# EAGLE design GSM_GPS (EAGLE 9.6.2)
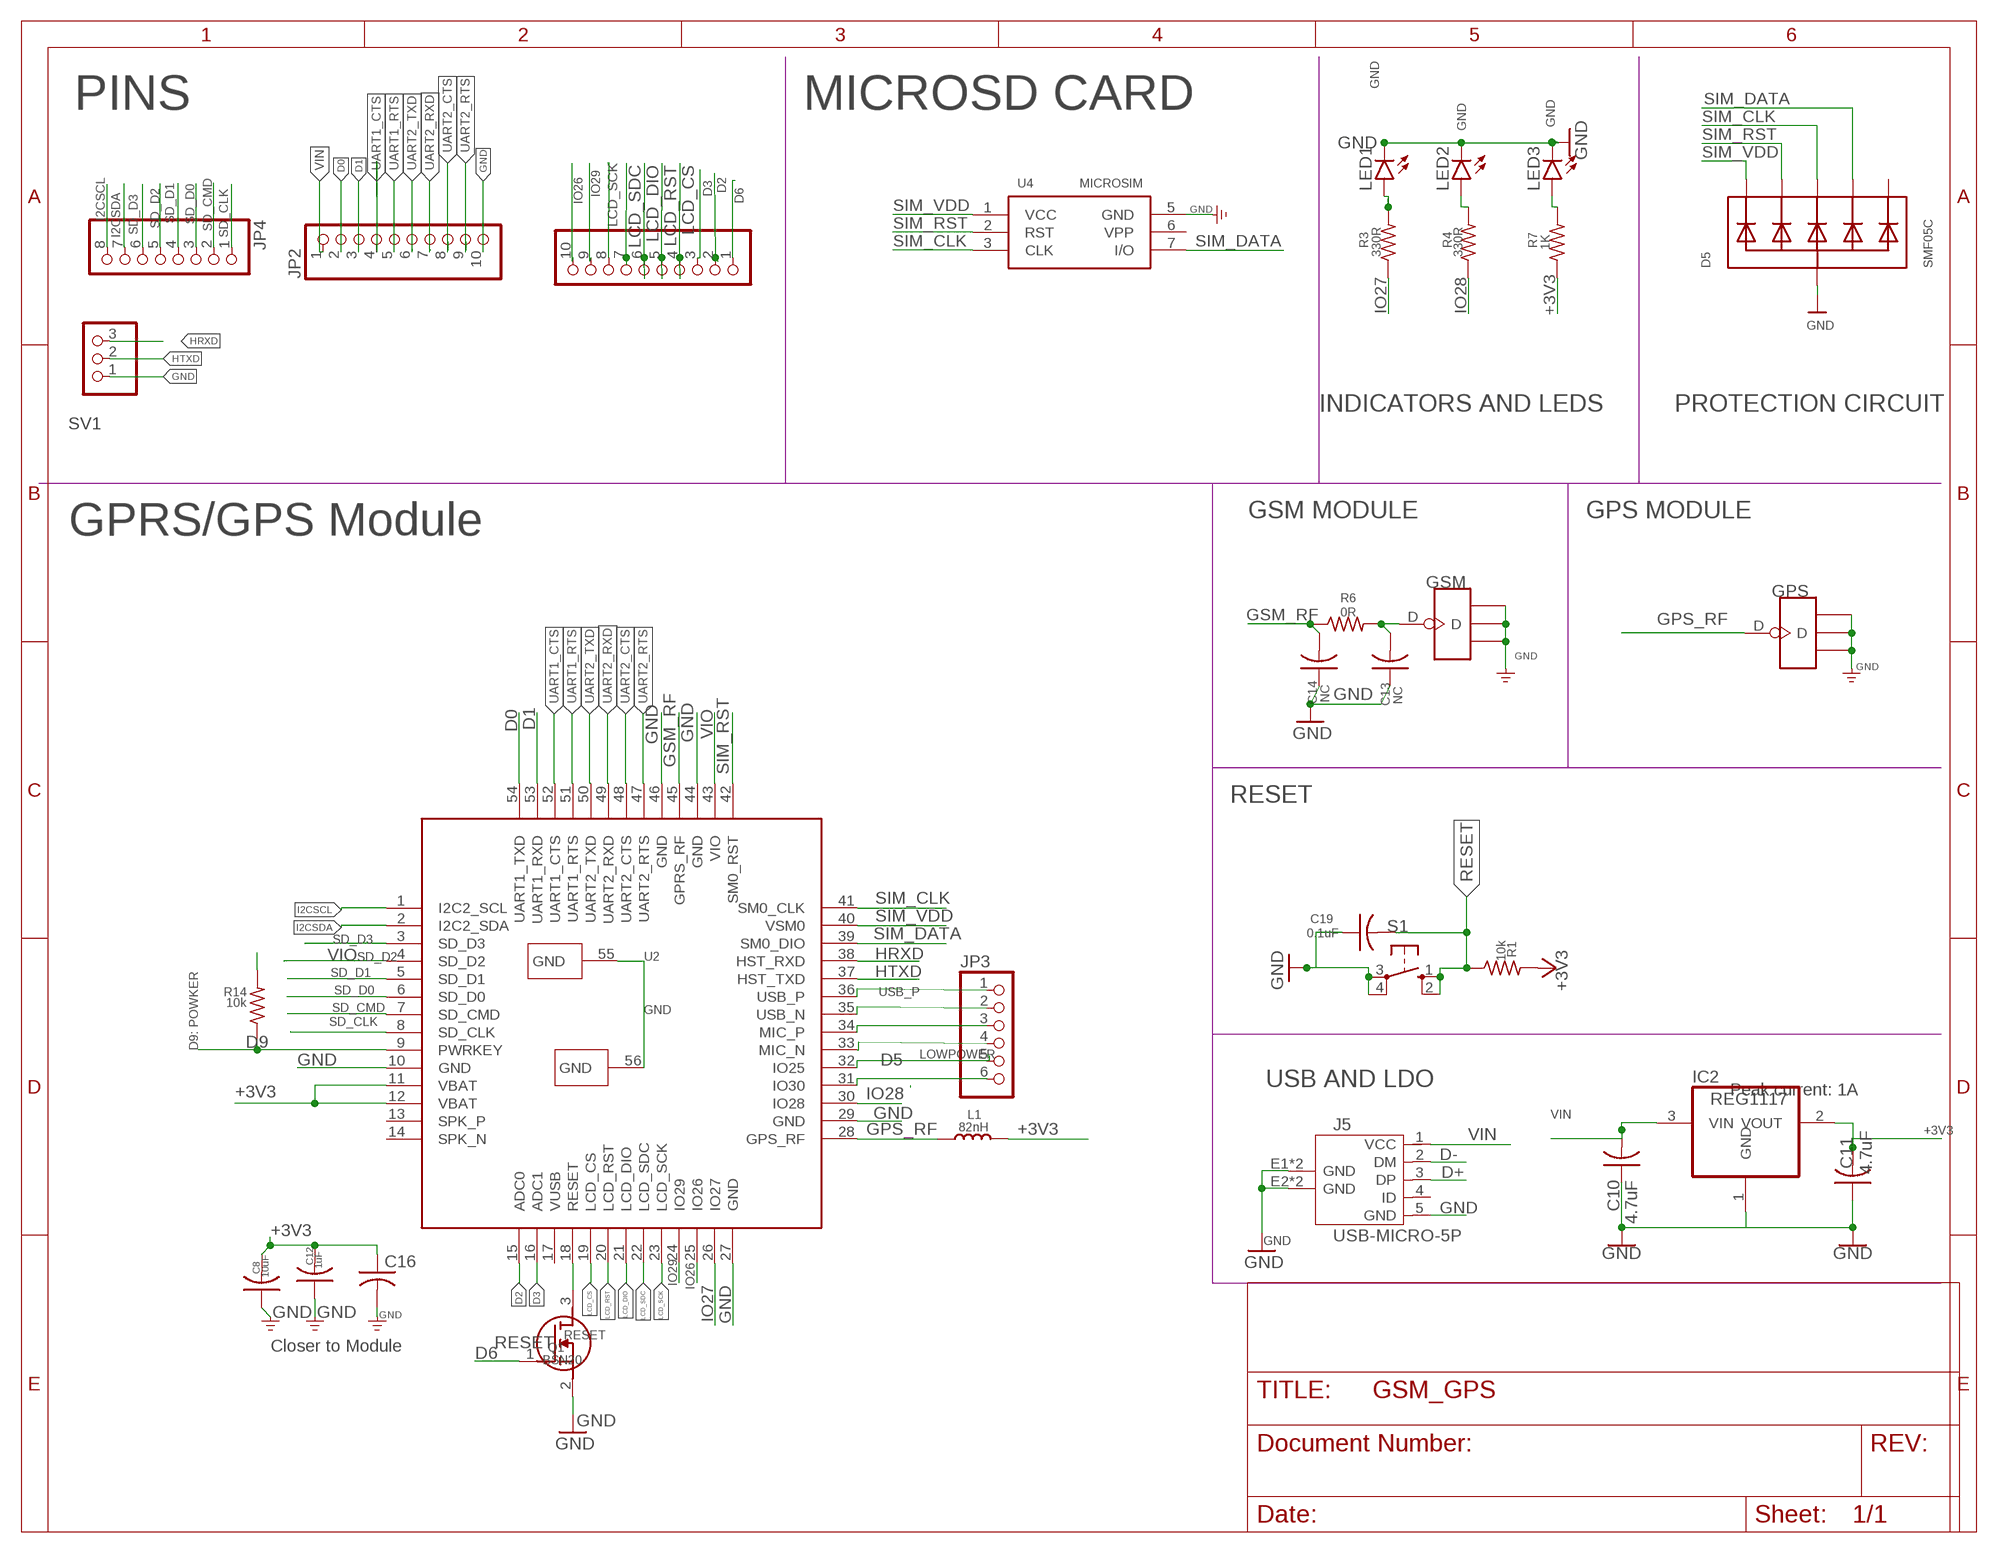
[diagram p0: schematic, sheet 1]

## Parts
C8  10uF  C-USC0805  [C0805]
C10  4.7uF  C-USC0805  [C0805]
C11  4.7uF  C-USC0805  [C0805]
C12  1uF  C-USC0805  [C0805]
C13  NC  C-USC0805  [C0805]
C14  NC  C-USC0805  [C0805]
C16  100uF  C-USC0805  [C0805]
C19  0.1uF  C-USC0805  [C0805]
D5  SMF05C  TVSARRAY_5LANE  [SOT363]
GPS  ANTENNA-U-FL  [4P-U-FL]
GSM  ANTENNA-U-FL  [4P-U-FL]
IC2  REG1117  [SOT223]
J2  PINHD-1X10  [1X10]
J5  USB-MICRO-5P  [MICRO-USB-5P]
JP2  PINHD-1X10  [1X10]
JP3  PINHD-1X6  [1X06]
JP4  PINHD-1X8  [1X08]
L1  82nH  L'0603'  [L0603]
LED1  LEDCHIPLED_0805  [CHIPLED_0805]
LED2  LEDCHIPLED_0805  [CHIPLED_0805]
LED3  LEDCHIPLED_0805  [CHIPLED_0805]
Q1  BSN20  SI2302CDS-T1-E3  [SOT95P237X112-3N]
R1  10k  R-US_R0805  [R0805]
R3  330R  R-US_R0805  [R0805]
R4  330R  R-US_R0805  [R0805]
R6  0R  R-US_R0805  [R0805]
R7  1K  R-US_R0805  [R0805]
R14  10k  R-US_R0805  [R0805]
S1  10-XX  [B3F-10XX]
SV1  PINHD-1X3  [1X03]
U2  A9G  [A9G]
U4  MICROSIM  [MICROSIM]

## Nets
+3V3: C8.2 C11.2 C12.2 C16.1 IC2.2(VOUT) L1.2 R1.2 R7.1 U2.11(VBAT) U2.12(VBAT)
D0: JP2.2 U2.54(UART1_TXD)
D1: JP2.3 U2.53(UART1_RXD)
D2: J2.2 U2.15(ADC0)
D3: J2.3 U2.16(ADC1)
D5: JP3.5 U2.32(IO25)
D6: J2.1 Q1.1(G)
D9: R14.1 U2.9(PWRKEY)
D+: J5.3(DP)
D-: J5.2(DM)
GND: C8.1 C10.1 C11.1 C12.1 C13.1 C14.1 C16.2 C19.1 D5.2(A) GPS.GND1 GPS.GND2 GPS.GND3 GSM.GND1 GSM.GND2 GSM.GND3 IC2.1(GND) J5.5(GND) J5.E1(GND) J5.E2(GND) J5.P1(GND) J5.P2(GND) JP2.10 LED1.C LED2.C LED3.C Q1.2(S) S1.3(P) S1.4(P1) SV1.1 U2.10(GND) U2.27(GND) U2.29(GND) U2.44(GND) U2.46(GND) U2.55(GND) U2.56(GND) U4.5(GND)
GPS_RF: GPS.D L1.1 U2.28(GPS_RF)
GSM_RF: C14.2 R6.1 U2.45(GPRS_RF)
HRXD: SV1.3 U2.38(HST_RXD)
HTXD: SV1.2 U2.37(HST_TXD)
I2CSCL: JP4.8 U2.1(I2C2_SCL)
I2CSDA: JP4.7 U2.2(I2C2_SDA)
IO26: J2.10 U2.25(IO26)
IO27: R3.1 U2.26(IO27)
IO28: R4.1 U2.30(IO28)
IO29: J2.9 U2.24(IO29)
LCD_CS: J2.4 U2.19(LCD_CS)
LCD_DIO: J2.6 U2.21(LCD_DIO)
LCD_RST: J2.5 U2.20(LCD_RST)
LCD_SCK: J2.8 U2.23(LCD_SCK)
LCD_SDC: J2.7 U2.22(LCD_SDC)
N$1: LED2.A R4.2
N$2: JP3.6 U2.31(IO30)
N$3: LED3.A R7.2
N$4: JP3.3 U2.34(MIC_P)
N$5: JP3.4 U2.33(MIC_N)
N$7: LED1.A R3.2
N$8: JP3.2 U2.35(USB_N)
N$94: C13.2 GSM.D R6.2
RESET: C19.2 Q1.3(D) R1.1 S1.1(S) S1.2(S1) U2.18(RESET)
SD_CLK: JP4.1 U2.8(SD_CLK)
SD_CMD: JP4.2 U2.7(SD_CMD)
SD_D0: JP4.3 U2.6(SD_D0)
SD_D1: JP4.4 U2.5(SD_D1)
SD_D2: JP4.5 U2.4(SD_D2)
SD_D3: JP4.6 U2.3(SD_D3)
SIM_CLK: D5.4(C3) U2.41(SM0_CLK) U4.3(CLK)
SIM_DATA: D5.5(C4) U2.39(SM0_DIO) U4.7(I/O)
SIM_RST: D5.3(C2) U2.42(SM0_RST) U4.2(RST)
SIM_VDD: D5.1(C1) U2.40(VSM0) U4.1(VCC)
UART1_CTS: JP2.4 U2.52(UART1_CTS)
UART1_RTS: JP2.5 U2.51(UART1_RTS)
UART2_CTS: JP2.8 U2.48(UART2_CTS)
UART2_RTS: JP2.9 U2.47(UART2_RTS)
UART2_RXD: JP2.7 U2.49(UART2_RXD)
UART2_TXD: JP2.6 U2.50(UART2_TXD)
USB_P: JP3.1 U2.36(USB_P)
VIN: C10.2 IC2.3(VIN) J5.1(VCC) JP2.1
VIO: R14.2 U2.43(VIO)
Unconnected: D5.6(C5) J5.4(ID) U2.13(SPK_P) U2.14(SPK_N) U2.17(VUSB) U4.6(VPP)

## Notes on the sheet
- PINS | MICROSD CARD
- INDICATORS AND LEDS
- PROTECTION CIRCUIT
- GSM MODULE | GPS MODULE
- GPRS/GPS Module
- RESET
- D9: POWKER
- LOWPOWER
- USB AND LDO
- Peak current: 1A
- RESET
- Closer to Module

## Library data of the parts
C8 C10-C14 C16 C19 = rcl:C-US: CAPACITOR, American symbol; SPICEPREFIX: C
D5 = microbuilder:TVSARRAY_5LANE: Voltage Transient Suppressor Array SOT363 SMF05C - 100W 5V: Digikey - SMF05CT1GOSCT-ND
GPS GSM = Connector:ANTENNA-U-FL
IC2 = burr-brown:REG1117: 800mA and 1A Low Dropout (LDO) Positive Regulator 1.8V, 2.5V, 2.85V, 3.3V, 5V, and Adj; MPN: REG1117; OC_FARNELL: 1097566; OC_NEWARK: 14P6981
J2 JP2 = pinhead:PINHD-1X10: PIN HEADER
J5 = Connector:USB-MICRO-5P
JP3 = pinhead:PINHD-1X6: PIN HEADER
JP4 = pinhead:PINHD-1X8: PIN HEADER
L1 = Discrete:L*
LED1-LED3 = led:LED: LED OSRAM: - CHIPLED LG R971, LG N971, LY N971, LG Q971, LY Q971, LO R971, LY R971 LH N974, LH R974 LS Q976, LO Q976, LY Q976 LO Q996 - Hyper CHIPLED LW Q18S LB Q993, LB Q99A, LB R99A - SideLED LS A670, LO A670, LY A670, LG A670, LP A670 LB A673, LV A673, LT A673, LW A673 LH A674 LY A675 LS A676, LA A676, LO A676, LY A676, LW A676 LS A679, LY A679, LG A679 - Hyper Micro SIDELED® LS Y876, LA Y876, LO Y876, LY Y876 LT Y87S - SmartLED LW L88C, LW L88S LB L89C, LB L89S, LG L890 LS L89K, LO L89K, LY L89K LS L896, LA L896, LO L896, LY L896 - TOPLED LS T670, LO T670, LY T670, LG T670, LP T670 LSG T670, LSP T670, LSY T670, LOP T670, LYG T670 LG T671, LOG T671, LSG T671 LB T673, LV T673, LT T673, LW T673 LH T674 LS T676, LA T676, LO T676, LY T676, LB T676, LH T676, LSB T676, LW T676 LB T67C, LV T67C, LT T67C, LS T67K, LO T67K, LY T67K, LW E67C LS E67B, LA E67B, LO E67B, LY E67B, LB E67C, LV E67C, LT E67C LW T67C LS T679, LY T679, LG T679 LS T770, LO T770, LY T770, LG T770, LP T770 LB T773, LV T773, LT T773, LW T773 LH T774 LS E675, LA E675, LY E675, LS T675 LS T776, LA T776, LO T776, LY T776, LB T776 LHGB T686 LT T68C, LB T68C - Hyper Mini TOPLED® LB M676 - Mini TOPLED Santana® LG M470 LS M47K, LO M47K, LY M47K Source: http://www.osram.convergy.de LUXEON: - LUMILED® LXK2-PW12-R00, LXK2-PW12-S00, LXK2-PW14-U00, LXK2-PW14-V00 LXK2-PM12-R00, LXK2-PM12-S00, LXK2-PM14-U00 LXK2-PE12-Q00, LXK2-PE12-R00, LXK2-PE12-S00, LXK2-PE14-T00, LXK2-PE14-U00 LXK2-PB12-K00, LXK2-PB12-L00, LXK2-PB12-M00, LXK2-PB14-N00, LXK2-PB14-P00, LXK2-PB14-Q00 LXK2-PR12-L00, LXK2-PR12-M00, LXK2-PR14-Q00, LXK2-PR14-R00 LXK2-PD12-Q00, LXK2-PD12-R00, LXK2-PD12-S00 LXK2-PH12-R00, LXK2-PH12-S00 LXK2-PL12-P00, LXK2-PL12-Q00, LXK2-PL12-R00 Source: www.luxeon.com KINGBRIGHT: KA-3528ASYC Source: www.kingbright.com
Q1 = SamacSys_Parts:SI2302CDS-T1-E3: VISHAY - SI2302CDS-T1-E3 - MOSFET Transistor, N Channel, 2.6 A, 20 V, 0.045 ohm, 4.5 V, 400 mV Source: Datasheet <https://labcenter.componentsearchengine.com/Datasheets/2/SI2302CDS-T1-E3.pdf>; ARROW_PART_NUMBER: SI2302CDS-T1-E3; ARROW_PRICE-STOCK: https://www.arrow.com/en/products/si2302cds-t1-e3/vishay; DESCRIPTION: VISHAY - SI2302CDS-T1-E3 - MOSFET Transistor, N Channel, 2.6 A, 20 V, 0.045 ohm, 4.5 V, 400 mV; HEIGHT: 1.12mm; MANUFACTURER_NAME: Vishay; MANUFACTURER_PART_NUMBER: SI2302CDS-T1-E3; MOUSER_PART_NUMBER: 781-SI2302CDS-E3; MOUSER_PRICE-STOCK: https://www.mouser.co.uk/ProductDetail/Vishay-Semiconductors/SI2302CDS-T1-E3?qs=%252BPu8jn5UVnHNrjAmGCs%2Fuw%3D%3D
R1 R3 R4 R6 R7 R14 = rcl:R-US_: RESISTOR, American symbol; SPICEPREFIX: R
S1 = switch-omron:10-XX: OMRON SWITCH; MPN: B3F-1000; OC_FARNELL: 176432; OC_NEWARK: 36M3542
SV1 = pinhead:PINHD-1X3: PIN HEADER
U2 = A9G:A9G
U4 = Connector:MICROSIM

## Net classes
0 default: width 0.203 mm, drill 0.305 mm, clearance 0.152 mm

## Board
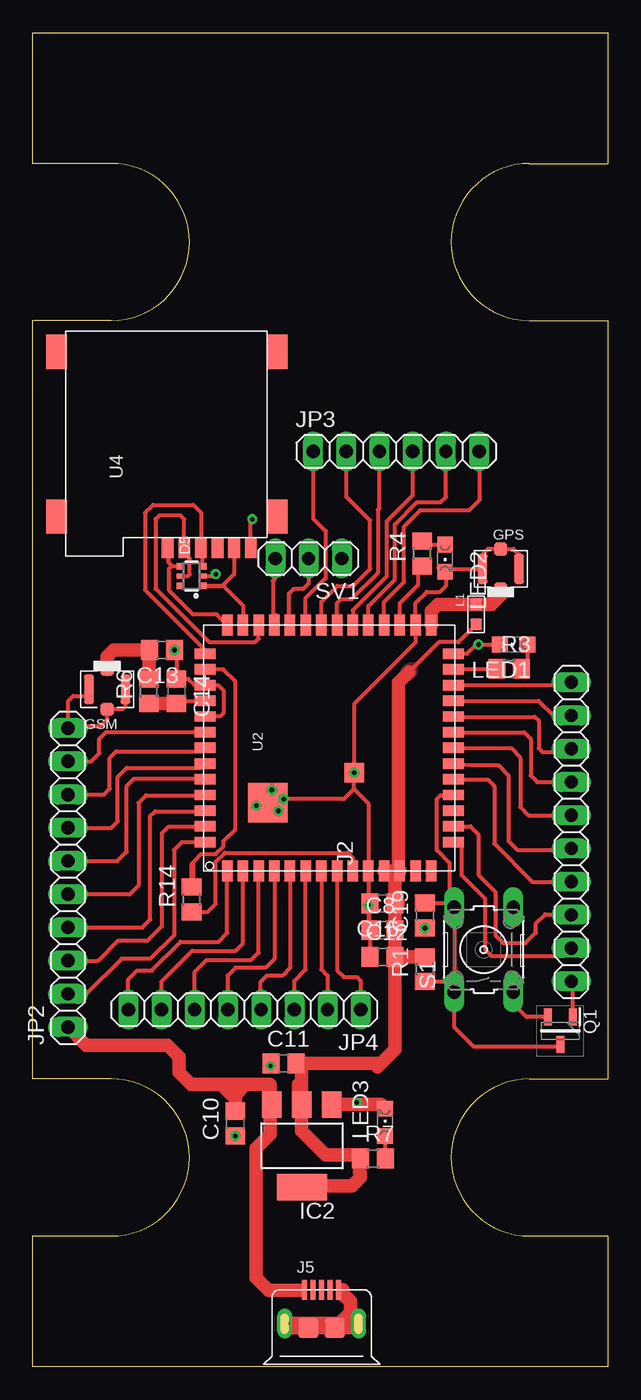
[diagram p1: board, top side]
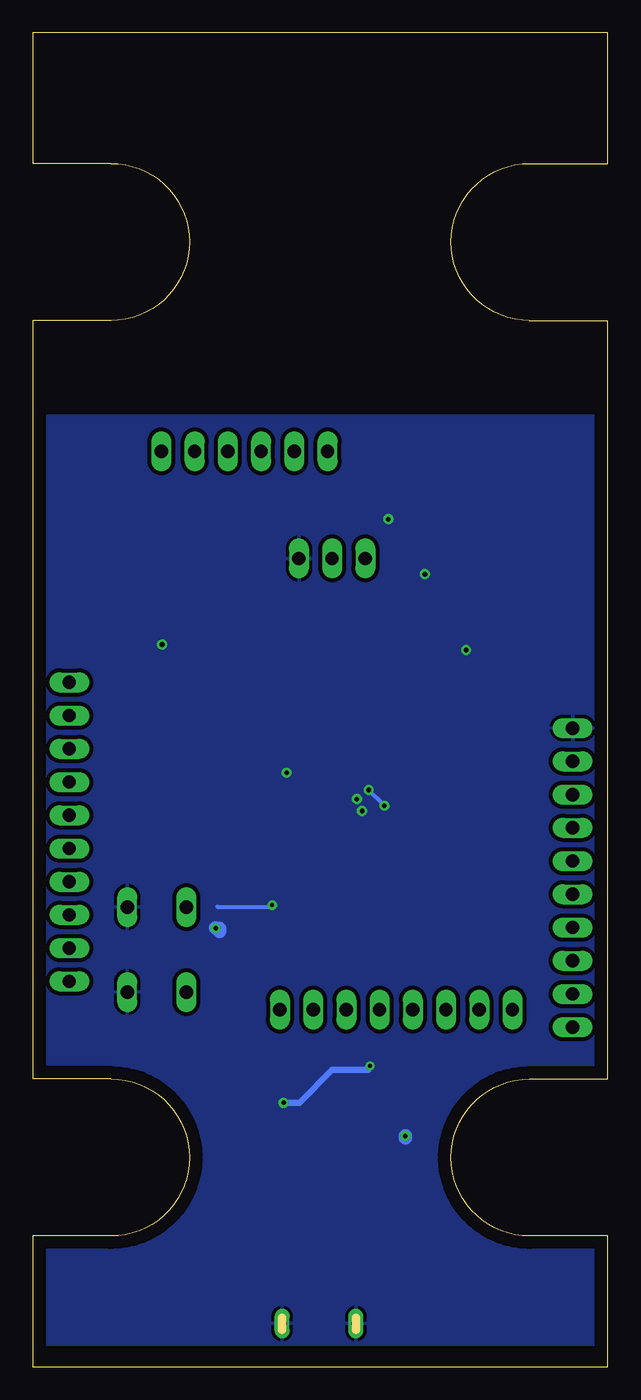
[diagram p2: board, bottom side, seen from below]

Size 44 x 102 mm. Coordinates in mm from the lower left corner, seen from the top.
Outline: 0,0 0,10 6,10 arc90 12,16 arc90 6,22 0,22 0,80 6,80 arc90 12,86 arc90 6,92 0,92 0,102 44,102 44,92 38,92 arc90 32,86 arc90 38,80 44,80 44,22 38,22 arc90 32,16 arc90 38,10 44,10 44,0 0,0
Copper layers (1*16): Top 0.035mm / dielectric 1.5mm / Bottom 0.035mm
Design rules "default *": minimum track width 0.3mm, minimum drill 0.35mm, track to track 0.3mm, track to pad 0.3mm, pad to pad 0.3mm, via to via 0.3mm, smd to smd 6mil, copper to edge 1mm, drill to drill 1mm, minimum pad ring 10mil, minimum via ring 8mil, stop-mask expansion 4mil, vias tented up to drill 0mil, thermal gap 10mil

### Footprints (pad centres in the part's own frame; a part is rotated, then mirrored left to right if it is on the bottom)
C0805 = smd 1.3 x 1.5: 1 -0.95,0; 2 0.95,0
SOT363 = smd 0.5 x 0.5: 1 -0.75,-0.9; 3 0.75,-0.9; 4 0.75,0.9; 6 -0.75,0.9 | smd 0.4 x 0.5: 2 0,-0.9; 5 0,0.9
4P-U-FL = smd 1.016 x 1.016: D -1.524,0; GND3 1.524,0 | smd 2.286 x 0.762: GND1 0,1.397; GND2 0,-1.397
SOT223 = smd 1.499 x 2.007: 1 -2.261,-3.15; 2 0.025,-3.15; 3 2.311,-3.15 | smd 3.81 x 2.007: 4 0,3.15
1X10 = drill 1.016 long: 1 -11.43,0; 2 -8.89,0; 3 -6.35,0; 4 -3.81,0; 5 -1.27,0; 6 1.27,0; 7 3.81,0; 8 6.35,0; 9 8.89,0; 10 11.43,0
MICRO-USB-5P = smd 0.38 x 1.52: 1 -1.3,0; 2 -0.65,0; 3 0,0; 4 0.65,0; 5 1.3,0 | smd 1.524 x 1.524: E1 -1.016,-2.921; E2 1.016,-2.921 | drill 0.635 pad 1.143 long: P1 -2.819,-2.591; P2 2.819,-2.591
1X06 = drill 1.016 long: 1 -6.35,0; 2 -3.81,0; 3 -1.27,0; 4 1.27,0; 5 3.81,0; 6 6.35,0
1X08 = drill 1.016 long: 1 -8.89,0; 2 -6.35,0; 3 -3.81,0; 4 -1.27,0; 5 1.27,0; 6 3.81,0; 7 6.35,0; 8 8.89,0
L0603 = smd 0.889 x 0.889: 1 -0.762,0; 2 0.762,0
CHIPLED_0805 = smd 1.2 x 1.2: A 0,-1.05; C 0,1.05
SOT95P237X112-3N = smd 1.3 x 0.6: 1 -1.05,0.95; 2 -1.05,-0.95; 3 1.05,0
R0805 = smd 1.3 x 1.5: 1 -0.95,0; 2 0.95,0
B3F-10XX = drill 1.016 long: 1 -3.251,2.261; 2 3.251,2.261; 3 -3.251,-2.261; 4 3.251,-2.261
1X03 = drill 1.016 long: 1 -2.54,0; 2 0,0; 3 2.54,0
A9G = smd 1.6 x 0.8: 1 -9.4,7.8; 2 -9.4,6.6; 3 -9.4,5.4; 4 -9.4,4.2; 5 -9.4,3; 6 -9.4,1.8; 7 -9.4,0.6; 8 -9.4,-0.6; 9 -9.4,-1.8; 10 -9.4,-3; 11 -9.4,-4.2; 12 -9.4,-5.4; 13 -9.4,-6.6; 14 -9.4,-7.8; 28 9.4,-7.8; 29 9.4,-6.6; 30 9.4,-5.4; 31 9.4,-4.2; 32 9.4,-3; 33 9.4,-1.8; 34 9.4,-0.6; 35 9.4,0.6; 36 9.4,1.8; 37 9.4,3; 38 9.4,4.2; 39 9.4,5.4; 40 9.4,6.6; 41 9.4,7.8 | smd 0.8 x 1.6: 15 -7.2,-9.5; 16 -6,-9.5; 17 -4.8,-9.5; 18 -3.6,-9.5; 19 -2.4,-9.5; 20 -1.2,-9.5; 21 0,-9.5; 22 1.2,-9.5; 23 2.4,-9.5; 24 3.6,-9.5; 25 4.8,-9.5; 26 6,-9.5; 27 7.2,-9.5; 42 7.2,9.5; 43 6,9.5; 44 4.8,9.5; 45 3.6,9.5; 46 2.4,9.5; 47 1.2,9.5; 48 0,9.5; 49 -1.2,9.5; 50 -2.4,9.5; 51 -3.6,9.5; 52 -4.8,9.5; 53 -6,9.5; 54 -7.2,9.5 | smd 3 x 3: 55 -4.2,4.7 | smd 1.5 x 1.5: 56 -1.9,-1.9
MICROSIM = smd 1.5 x 0.9: 1 -0.8,2.5; 2 -0.8,5.04; 3 -0.8,7.58; 5 -0.8,1.23; 6 -0.8,3.77; 7 -0.8,6.31 | smd 2.61 x 1.56: P$1 1.6,-0.8; P$2 14.2,-0.8; P$3 14.2,16.1; P$4 1.6,16.1

### Placement (x,y rotation side)
C8  26.75,33.39 0 top
C10  15.5,18.6 90 top
C11  19.2,23.2 0 top
C12  26.75,31.34 0 top
C13  9.9,54.8 180 top
C14  11,51.65 270 top
C16  26.75,35.43 180 top
C19  30,34.5 90 top
D5  12.15,60.45 90 top
GPS  35.8,61 90 top
GSM  5.7,51.8 270 top
IC2  20.6,16.9 180 top
J2  41.2,40.9 90 top
J5  22.1,5.9 0 top
JP2  2.7,37.4 90 top
JP3  27.8,70 0 top
JP4  16.2,27.3 180 top
L1  33.92,57.53 270 top
LED1  36.79,55.22 90 top
LED2  31.54,61.82 180 top
LED3  26.95,18.68 0 top
Q1  40.35,25.69 270 top
R1  30,30.4 90 top
R3  36.44,53.37 0 top
R4  29.8,62.17 90 top
R6  8.9,51.65 90 top
R7  26.03,15.94 0 top
R14  12.16,35.74 90 top
S1  34.5,31.9 90 top
SV1  21.1,61.8 180 top
U2  22.68,47.32 90 top
U4  17.91,63.4 90 top

### Tracks (layer width: path | path; a pad name or v marks a point on that pad's centre or on a via)
+3V3
  Top 0.3: 27,38 U2.11 26.8,37.84 | 27.9,38 U2.12 28,37.9 27.98,38.02 | 27.8,33.2 27.8,33.14 | 27.8,33.14 27.8,31.39 27.72,31.35 C12.2 | 27.8,33.14 C8.2 27.8,33.53 27.8,35.26 C16.1 27.69,35.7 | 25.08,16.2 R7.1 | 28.79,53.11 31.09,55.41 | 20.57,21.1 20.34,21.1
  Top 0.305: L1.2 32.56,55.41 31.09,55.41
  Top 0.508: 27.69,31.7 C8.2 27.72,33.36 | 27.63,35.43 C16.1 27.72,35.4 27.72,33.36 | 27.63,35.43 28.08,35.88 | 27.63,35.43 27.32,35.12 | 27.72,33.36 27.72,31.35 | C12.2 27.79,31.24 | 20.34,21.6 20.34,21.84 20.45,21.95
  Top 0.61: C12.2 27.69,31.7 27.69,32.04 | 25.08,14.5 25.08,14.8 R7.1 | 19.9,13.9 19.95,13.85
  Top 1.016: 19.95,13.85 24.43,13.85 25.08,14.5 | 25.08,14.8 24.99,14.89 | 20.34,21.6 20.34,21.1 20.34,20.29 | C12.2 27.69,24.25 26.64,23.2 | 26.64,23.2 26.37,22.93 | C12.2 C16.1 27.69,37.3 27,38 | 27.98,35.44 27.8,35.26 | 25.08,16.2 22.4,16.2 20.57,18.02 IC2.2 20.57,21.1 20.57,22.77 C11.2 26.64,23.2 | 28.79,53.11 27.98,52.3 27.98,38.02 | U2.12 U2.11 | C12.2 R1.2
  pour Top: 28.2,53.2 28.9,52.5 29.4,53 29.4,53.1 29.4,53.8 28.8,53.8 28.7,53.7 28.6,53.7 28.2,53.3
D0
  Top 0.3: 13.12,40.05 U2.54 13.16,40.1 11.4,40.1 10.8,39.5 10.8,33 9,31.2 6.79,31.2 4.1,28.51 JP2.2 | 2.75,28.55 JP2.2 | 1.7,28.3 2.7,28.3 JP2.2
D1
  Top 0.3: 12.88,41.05 13.12,41.3 | 13.12,41.3 U2.53 | JP2.3 5,31.05 6.5,32.55 8.75,32.55 9.9,33.7 9.9,40.8 10.4,41.3 13.12,41.3
D2
  Top 0.3: U2.15 32.58,40.12 32.8,39.9 32.8,37.6 34.6,35.8 34.6,31.9 35.1,31.4 40.59,31.4 J2.2
D3
  Top 0.3: 41.15,34.5 J2.3
  Top 0.305: U2.16 33.48,41.32 34.1,40.7 34.1,37.6 35.4,36.3 35.4,33 36,32.4 37.7,32.4 38.5,33.2 38.5,33.9 39.2,34.6 41.9,34.6 41.8,34.5 41.15,34.5
D5
  Top 0.3: U2.32 25.68,58.18 27.7,60.2 27.7,64.4 29.4,66.1 31.2,66.1 31.61,66.51 JP3.5
D6
  Top 0.3: Q1.1 41.3,29.37 J2.1
D9
  Top 0.3: U2.9 24.48,38.92 24.1,39.3 14.7,39.3 14,38.6 14,35.4 13.39,34.79 R14.1
GND  (via drill 0.3, 0.35)
  Top 0.3: U4.5 16.68,64.68 v16.8,64.8 | D5.2 13.85,60.45 v14,60.6 | 31.31,61 LED2.C | LED2.C 31.33,60.77 31,61.1 | 29.44,56.88 U2.29 29.28,55.38 24.58,50.68 U2.56 24.58,44.18 | U2.27 33.22,54.52 33.92,55.22 v34.1,55.22 LED1.C 35.8,55.3 | 24.58,44.18 23.8,43.4 v19.2,43.4 18.26,43.4 U2.55 17.32,43.12 v17.1,42.9 | U2.10 25.68,43.08 24.58,44.18 | LED3.C 26.49,20.19 v24.8,20.19 24.99,20 | 25.71,35.3 25.71,35.5 25.78,35.43 C16.2 25.68,35.55 U2.10 | 25.71,35.3 25.71,33.48 C8.1 25.79,33.1 | 13.13,52.07 U2.44 14.18,52.12 14.6,51.7 14.6,50 14.32,49.72 U2.46 | 31.7,61 31.7,60.6 LED2.C | 25.79,33.1 C12.1 | C12.1 | 25.7,32 25.69,32 25.6,31.9 25.9,31.9 C12.1 | U2.10 25.68,35.33 25.71,35.3 | U2.10 v25.68,35.3 25.68,33.21 25.79,33.1 | v18.2,23 18.4,23.2 C11.1 | Q1.2 37.76,26.74 36.9,27.6 | 36.9,27.6 36.78,27.72 | 20.8,2.98 20.8,3.1 J5.E1 | J5.5 23.5,6.1 23.75,5.9 | 36.9,27.6 37,27.7 37,28.6 S1.3
  Top 0.305: U2.29 29.28,58.38 30.15,59.25 31.15,59.25 31.64,59.74 31.64,60.67 LED2.C 31.77,61 GPS.GND1 | GPS.GND1 | GPS.GND1 34.4,62.1 34.82,62.52 GPS.GND3 36.78,62.52 37.2,62.1 GPS.GND2 | GSM.GND2 4.4,51.7 4.4,51.3 3.1,51.3 2.7,50.9 JP2.10 2.87,49 5.2,49 5.7,49.5 GSM.GND3 6.88,50.28 7.1,50.5 GSM.GND1 | C13.1 11,54.65 C14.1 11.9,52.6 12.38,52.12 U2.44 12.98,51.92
  Top 1.016: IC2.1 26.63,20.05 LED3.C | J5.E2 24.3,4.16 24.3,5 23.75,5.55 23.75,5.9 | J5.E2 J5.E1 20.8,2.98 19.61,2.98 J5.P1 J5.P2 24.59,2.98 J5.E2
  Bottom 0.3: v17.1,42.9 v18.3,44.1 | 18.3,22.7 18.2,22.8 v18.2,23
  Bottom 0.305: 29.89,35.17 25.73,35.17 25.6,35.3 v25.68,35.3 | C13.1 10.8,54.8
  Bottom 0.508: v24.8,20.19 23.6,20.19 21.09,22.7 18.3,22.7
  Bottom 1.016: C10.1 15.5,17.5 | C19.1 29.95,33.5 29.7,33.5 29.7,33.3
  other vias: 18.8,42.5 24.58,45.42 15.5,17.65 10.85,54.8 30,33.55
  pour Bottom: -1.1,1.6 44,1.6 47.6,5.2 47.6,68.6 43.4,72.8 -2.2,72.8 -4,71 -4,4.5
GPS_RF
  Top 0.3: U2.28 30.38,56.82 30.38,57.95 30.72,58.29 31,58.29 31.3,58.29
  Top 1.016: GPS.D 35.8,59 35.09,58.29 L1.1 31.3,58.29 | U2.28 30.48,57.77 31,58.29
GSM_RF
  Top 0.305: C14.2 11.22,50.92 U2.45
  Top 1.016: 8.92,50.72 R6.1 C14.2
HRXD
  Top 0.3: 18.6,57.5 18.6,56.9 U2.38 18.38,56.82 18.38,60.08 18.5,60.2 18.5,61.6 | 18.5,61.6 18.5,61.9 | 18.5,61.6 18.4,61.6 SV1.3
HTXD
  Top 0.3: 19.8,56.9 U2.37 | U2.37 19.78,56.82 | U2.37 19.58,56.82 19.58,59.08 20,59.5 20.7,59.5 21.1,59.9
  Top 0.305: SV1.2 21.1,59.9
I2CSCL
  Top 0.3: U2.1 14.88,33.18 14.2,32.5 11.3,32.5 9.1,30.3 8,30.3 7.31,29.61 JP4.8
I2CSDA
  Top 0.3: JP4.7 9.85,29.45 12.2,31.8 15.5,31.8 16.08,32.38 U2.2
IO26
  Top 0.3: U2.25 32.4,52.1 40.5,52.1 40.66,52.26 J2.10
IO27
  Top 0.3: R3.1 35.44,53.32 U2.26
IO28
  Top 0.3: R4.1 30.03,60.99 | 28.23,56.87 U2.30 28.08,58.38
  Top 0.305: 28.08,58.38 29.5,59.8 29.5,60.92 R4.1
IO29
  Top 0.3: U2.24 38.68,50.92 39.81,49.79 J2.9
LCD_CS
  Top 0.3: U2.19 32.4,44.9 34.8,44.9 35.3,44.4 35.3,40
  Top 0.305: 35.3,40 38.21,37.09 J2.4
LCD_DIO
  Top 0.3: U2.21 32.4,47.3 36.6,47.3 37.3,46.6 37.3,42.8 37.93,42.17 J2.6
LCD_RST
  Top 0.3: U2.20 33.5,46 35.6,46 36.4,45.2 36.4,40.2 37.07,39.53 41.2,39.53 J2.5
LCD_SCK
  Top 0.3: U2.23 32.4,49.7 38.4,49.7 38.7,49.4 38.7,47.3 39,47 41.2,47 J2.8 40.8,47.21 40.25,46.85
LCD_SDC
  Top 0.3: U2.22 32.4,48.5 37.6,48.5 38.1,48 38.1,45.2 38.59,44.71 J2.7 | J2.7 41.11,44.15 40.89,44.71 | 41.06,44.85 J2.7
N$1
  Top 0.3: R4.2 30.05,62.87 LED2.A
N$2
  Top 0.3: U2.31 26.88,58.48 28.4,60 28.4,64.25 29.65,65.5 33.4,65.5 34.2,66.3 34.2,69.95 JP3.6
N$3
  Top 0.3: LED3.A 26.95,15.97 R7.2
N$4
  Top 0.3: U2.34 23.28,58.38 23.6,58.7 24.4,58.7 26.4,60.7 26.4,65.51 26.53,65.64 JP3.3
N$5
  Top 0.3: U2.33 24.48,57.85 27.09,60.46 27.09,64.66 29.07,66.64 JP3.4
N$7
  Top 0.3: 38.29,55.1 LED1.A 37.84,53.82 R3.2
N$8
  Top 0.3: U2.35 22.08,58.48 23.3,59.7 24.5,59.7 25.8,61 25.8,64.7 23.99,66.51 JP3.2
N$94
  Top 1.016: GSM.D 5.7,54.3 6.2,54.8 C13.2 8.9,54.75 R6.2
RESET
  Top 0.3: U2.18 32.1,43.7 31.2,43.7 30.9,43.4 30.9,39.5 31.9,38.5 31.9,35.2 | 31.9,35.19 31.9,35.2 | 32.26,25.94 33.7,24.5 40.21,24.5 Q1.3 | 31.9,35.2 32.2,35.2 S1.2 | 31.9,35.2 31.89,35.2
  Top 0.305: C19.2 31.64,35.45 31.89,35.2 31.9,35.19 | 32.26,25.94 32.24,25.96 S1.1 | R1.1 31.44,29.45 S1.1 | S1.2 S1.1
SD_CLK
  Top 0.3: U2.8 23.28,30.32 23.8,29.8 24.8,29.8 25.09,29.51 JP4.1
SD_CMD
  Top 0.3: U2.7 22.08,30.37 22.55,29.9 JP4.2
SD_D0
  Top 0.3: JP4.3 20.01,29.51 20.88,30.38 U2.6
SD_D1
  Top 0.3: U2.5 19.7,37.9 19.7,30.5 19.1,29.9 17.9,29.9 17.4,29.4 17.4,27.5 17.5,27.4 JP4.4
SD_D2
  Top 0.3: U2.4 18.48,31.18 17.8,30.5 15.5,30.5 14.9,29.9 14.9,27.33 JP4.5
SD_D3
  Top 0.3: JP4.6 12.39,30.19 13.3,31.1 16.7,31.1 17.28,31.68 U2.3
SIM_CLK
  Top 0.305: U4.3 10.4,62.53 10.4,61.5 10.7,61.2 D5.4 10.6,61.2 10.4,61 10.4,59.4 12.28,57.52 14.08,57.52 U2.41
SIM_DATA
  Top 0.3: U2.39 17.28,55.68 17,55.4 13.5,55.4
  Top 0.305: D5.5 11.85,60.45 12,60.6 12,61.78 11.8,61.98 11.8,62.4 U4.7 11.6,64.8 11.3,65.1 9.7,65.1 9.4,64.8 9.4,59.5 13.5,55.4
SIM_RST
  Top 0.3: U2.42 13.18,54.82 8.6,59.4
  Top 0.305: D5.3 12.95,61.3 12.95,62.52 U4.2 12.9,62.63 12.9,65.3 12.3,65.9 9.2,65.9 8.6,65.3 8.6,59.4
SIM_VDD
  Top 0.305: U2.40 16.08,58.22 14.6,59.7 D5.1 14.5,59.7 15.41,60.61 U4.1
UART1_CTS
  Top 0.3: U2.52 13.15,42.48 9.38,42.48 9,42.1 9,34.2 8.39,33.59 JP2.4 2.75,33.67
UART1_RTS
  Top 0.3: U2.51 13.16,43.7 8.67,43.7 8.1,43.12 8.1,36.8 7.4,36.1 2.82,36.1 2.75,36.17 | 2.75,36.17 3.12,36.17 | 2.75,36.17 JP2.5
UART2_CTS
  Top 0.3: 4,43.75 JP2.8 5.45,43.75 5.9,44.2 5.9,46.55 6.4,47.05 12.88,47.05 13.12,47.3 U2.48
UART2_RTS
  Top 0.3: JP2.9 4.49,46.29 5.1,46.9 5.1,48 5.62,48.52 U2.47
UART2_RXD
  Top 0.3: 4.16,41.21 JP2.7 6.01,41.21 6.5,41.7 6.5,45.1 7.2,45.8 12.88,45.8 13.12,46.05 U2.49
UART2_TXD
  Top 0.3: U2.50 13.12,44.97 7.77,44.97 7.2,44.4 7.2,39.4 6.47,38.67 JP2.6 | 3.25,38.57 2.79,38.57 JP2.6 | JP2.6 4.27,38.67
USB_P
  Top 0.3: U2.36 20.88,58.78 22.4,60.3 22.4,63.9 21.45,64.85 JP3.1
VIN
  Top 0.3: J5.1 20.8,6.1 20.5,5.85 | 18.16,19.9 18.1,19.9 IC2.3
  Top 0.508: 18.16,17.76 18.16,19.3 | 17.99,20.36 17.99,21.4 17.79,21.6 16.4,21.6 15.6,21.6
  Top 1.016: JP2.1 4.1,24.57 10.33,24.57 11.2,23.7 11.2,22.5 12.1,21.6 14.4,21.6 | 14.4,21.6 15.6,21.6 | 15.6,21.6 16.3,21.6 | 18.19,19.33 18.16,19.3 | 20.5,5.85 18.05,5.85 17.1,6.8 17.1,16.7 18.16,17.76 18.16,19.9 18.16,21.6 16.4,21.6 16.3,21.6 | C10.2 15.5,20.8 | 15.5,20.8 15.5,21.5 15.6,21.6 | 15.5,20.8 16.3,21.6 | 15.5,20.8 15.2,20.8 14.4,21.6
VIO
  Top 0.3: 12.26,38.56 12.9,39.2 14,39.2 14.6,39.8 | 12.26,38.56 12.26,36.96 | R14.2 12.16,38.46 12.26,38.56
  Top 0.305: 12.26,36.96 12.1,36.8 | 14.6,39.8 14.6,40.2 15.5,41.1 15.5,52.4 14.58,53.32 U2.43